# EAGLE design B683X (EAGLE 6.6.0)
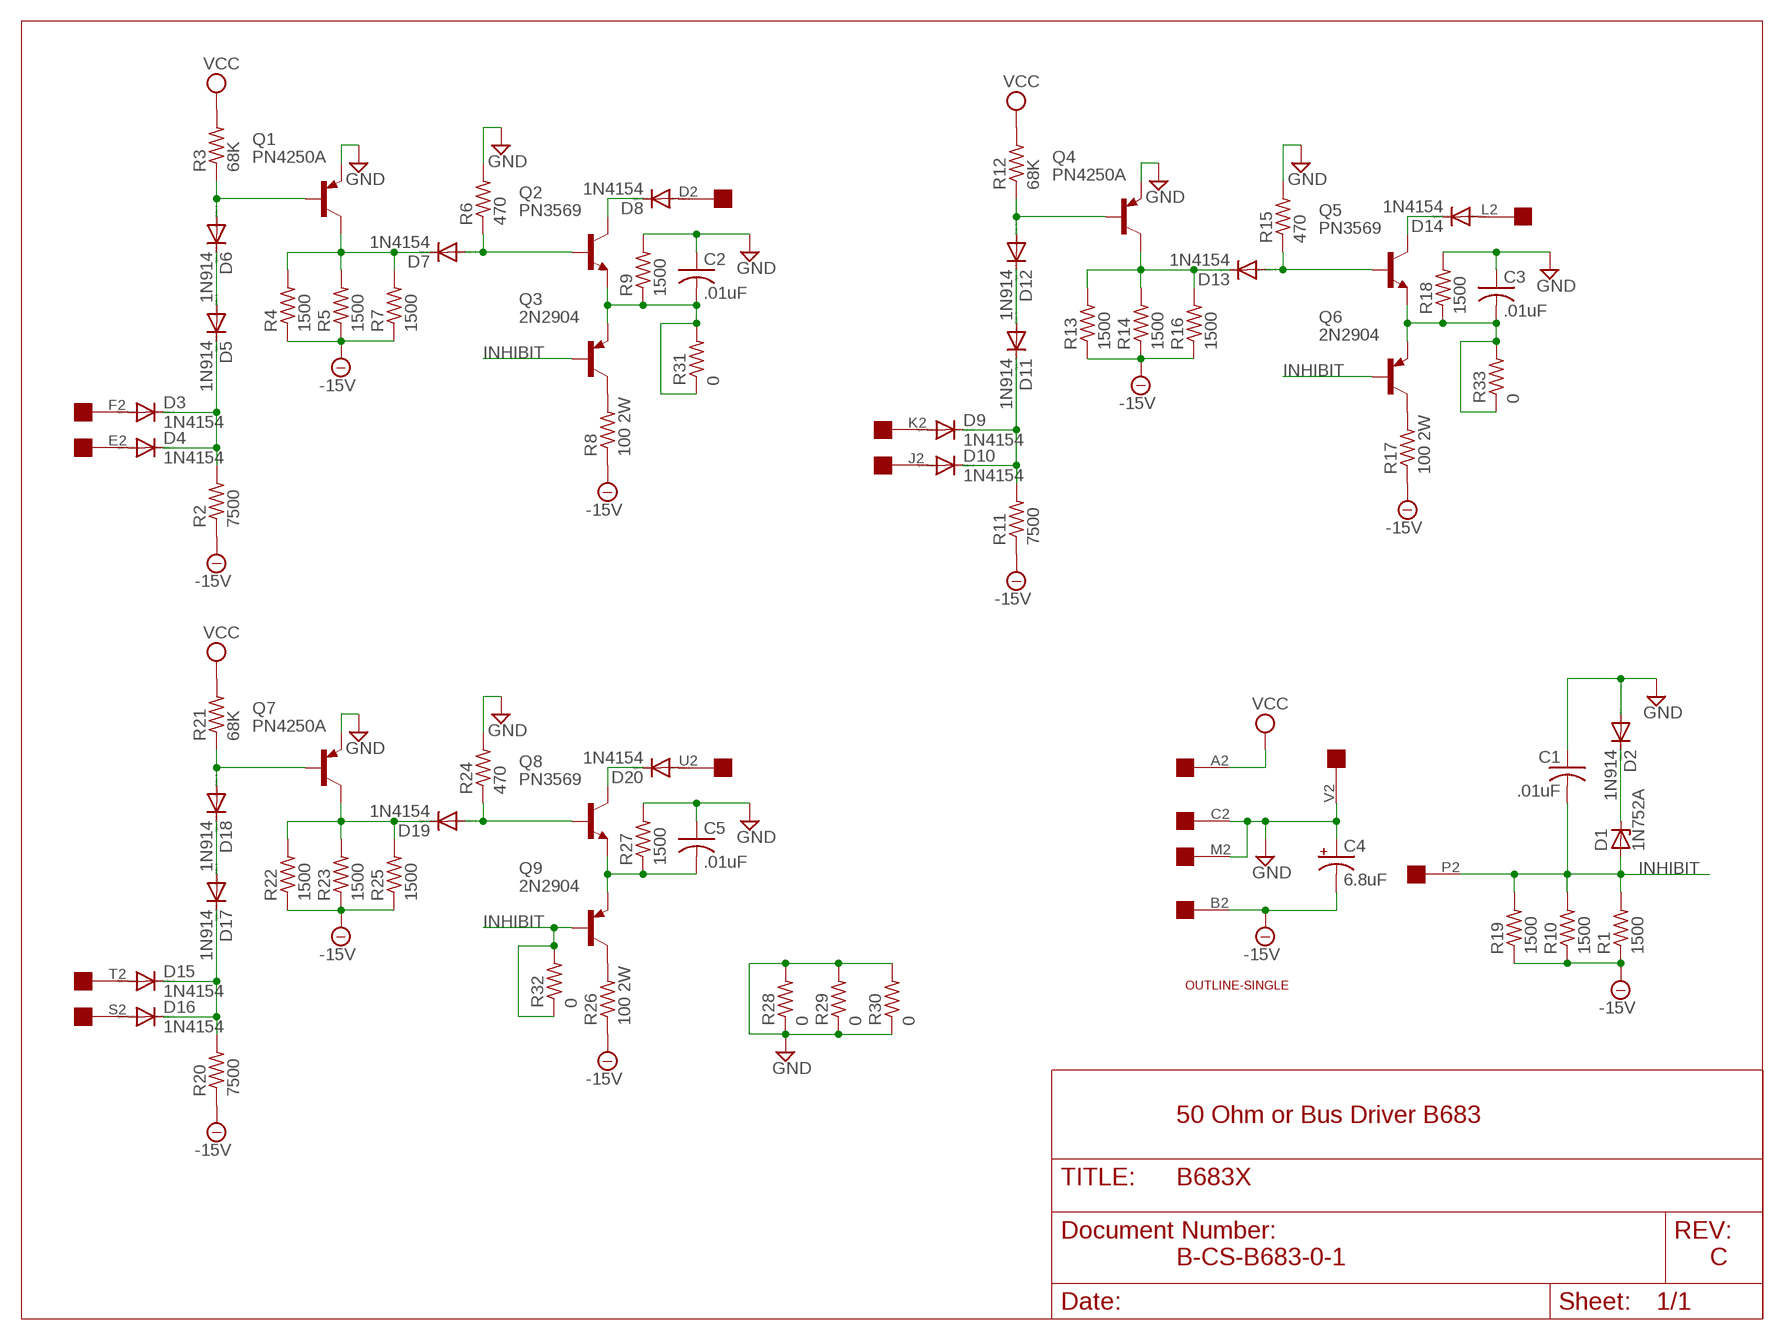
[diagram p0: schematic, sheet 1]

## Parts
C1  .01uF  C-US  [C063-025X075]
C2  .01uF  C-US  [C063-025X075]
C3  .01uF  C-US  [C063-025X075]
C4  6.8uF  CPOL-USE20-8AXIAL  [E12-8]
C5  .01uF  C-US  [C063-025X075]
D1  1N752A  ZENER-DIODEDO35Z10  [DO35Z10]
D2  1N914  DIODE-DO35-10  [DO35-10]
D3  1N4154  DIODE-DO35-10  [DO35-10]
D4  1N4154  DIODE-DO35-10  [DO35-10]
D5  1N914  DIODE-DO35-10  [DO35-10]
D6  1N914  DIODE-DO35-10  [DO35-10]
D7  1N4154  DIODE-DO35-10  [DO35-10]
D8  1N4154  DIODE-DO35-10  [DO35-10]
D9  1N4154  DIODE-DO35-10  [DO35-10]
D10  1N4154  DIODE-DO35-10  [DO35-10]
D11  1N914  DIODE-DO35-10  [DO35-10]
D12  1N914  DIODE-DO35-10  [DO35-10]
D13  1N4154  DIODE-DO35-10  [DO35-10]
D14  1N4154  DIODE-DO35-10  [DO35-10]
D15  1N4154  DIODE-DO35-10  [DO35-10]
D16  1N4154  DIODE-DO35-10  [DO35-10]
D17  1N914  DIODE-DO35-10  [DO35-10]
D18  1N914  DIODE-DO35-10  [DO35-10]
D19  1N4154  DIODE-DO35-10  [DO35-10]
D20  1N4154  DIODE-DO35-10  [DO35-10]
Q1  PN4250A  -PNP-TO5  [TO5]
Q2  PN3569  -NPN-TO5  [TO5]
Q3  2N2904  -PNP-TO5  [TO5]
Q4  PN4250A  -PNP-TO5  [TO5]
Q5  PN3569  -NPN-TO5  [TO5]
Q6  2N2904  -PNP-TO5  [TO5]
Q7  PN4250A  -PNP-TO5  [TO5]
Q8  PN3569  -NPN-TO5  [TO5]
Q9  2N2904  -PNP-TO5  [TO5]
R1  1500  R-US_0207/10  [0207/10]
R2  7500  R-US_0207/10  [0207/10]
R3  68K  R-US_0207/10  [0207/10]
R4  1500  R-US_0207/10  [0207/10]
R5  1500  R-US_0207/10  [0207/10]
R6  470  R-US_0207/10  [0207/10]
R7  1500  R-US_0207/10  [0207/10]
R8  100 2W  R-US_0818/25  [0818/25]
R9  1500  R-US_0207/10  [0207/10]
R10  1500  R-US_0207/10  [0207/10]
R11  7500  R-US_0207/10  [0207/10]
R12  68K  R-US_0207/10  [0207/10]
R13  1500  R-US_0207/10  [0207/10]
R14  1500  R-US_0207/10  [0207/10]
R15  470  R-US_0207/10  [0207/10]
R16  1500  R-US_0207/10  [0207/10]
R17  100 2W  R-US_0818/25  [0818/25]
R18  1500  R-US_0207/10  [0207/10]
R19  1500  R-US_0207/10  [0207/10]
R20  7500  R-US_0207/10  [0207/10]
R21  68K  R-US_0207/10  [0207/10]
R22  1500  R-US_0207/10  [0207/10]
R23  1500  R-US_0207/10  [0207/10]
R24  470  R-US_0207/10  [0207/10]
R25  1500  R-US_0207/10  [0207/10]
R26  100 2W  R-US_0818/25  [0818/25]
R27  1500  R-US_0207/10  [0207/10]
R28  0  R-US_0207/10  [0207/10]
R29  0  R-US_0207/10  [0207/10]
R30  0  R-US_0207/10  [0207/10]
R31  0  R-US_0207/10  [0207/10]
R32  0  R-US_0207/10  [0207/10]
R33  0  R-US_0207/10  [0207/10]
U$1  OUTLINE-SINGLE  [SINGLE]
U$2  EDGE-1  [EDGE-CON1]

## Nets
-15V: C4.- R1.1 R2.1 R4.1 R5.1 R7.1 R8.1 R10.1 R11.1 R13.1 R14.1 R16.1 R17.1 R19.1 R20.1 R22.1 R23.1 R25.1 R26.1 U$2.B2
GND: C1.1 C2.1 C3.1 C4.+ C5.1 D2.A Q1.1(E) Q4.1(E) Q7.1(E) R6.2 R9.2 R15.2 R18.2 R24.2 R27.2 R28.1 R28.2 R29.1 R29.2 R30.1 R30.2 U$2.C2 U$2.M2 U$2.V2
INHIBIT: C1.2 D1.A Q3.2(B) Q6.2(B) Q9.2(B) R1.2 R10.2 R19.2 R32.1 R32.2 U$2.P2
N$1: D6.A Q1.2(B) R3.1
N$2: D1.C D2.C
N$3: D3.C D4.C D5.C R2.2
N$4: D5.A D6.C
N$5: D7.C Q1.3(C) R4.2 R5.2 R7.2
N$6: D7.A Q2.2(B) R6.1
N$7: D8.C Q2.3(C)
N$8: C2.2 Q2.1(E) Q3.1(E) R9.1 R31.1 R31.2
N$9: Q3.3(C) R8.2
N$10: D12.A Q4.2(B) R12.1
N$11: D9.C D10.C D11.C R11.2
N$12: D11.A D12.C
N$13: D13.C Q4.3(C) R13.2 R14.2 R16.2
N$14: D13.A Q5.2(B) R15.1
N$15: D14.C Q5.3(C)
N$16: C3.2 Q5.1(E) Q6.1(E) R18.1 R33.1 R33.2
N$17: Q6.3(C) R17.2
N$18: D18.A Q7.2(B) R21.1
N$19: D15.C D16.C D17.C R20.2
N$20: D17.A D18.C
N$21: D19.C Q7.3(C) R22.2 R23.2 R25.2
N$22: D19.A Q8.2(B) R24.1
N$23: D20.C Q8.3(C)
N$24: C5.2 Q8.1(E) Q9.1(E) R27.1
N$25: Q9.3(C) R26.2
N$26: D8.A U$2.D2
N$27: D3.A U$2.F2
N$28: D4.A U$2.E2
N$29: D9.A U$2.K2
N$30: D10.A U$2.J2
N$31: D14.A U$2.L2
N$32: D20.A U$2.U2
N$33: D15.A U$2.T2
N$34: D16.A U$2.S2
VCC: R3.2 R12.2 R21.2 U$2.A2
Unconnected: U$2.H2 U$2.N2 U$2.R2

## Notes on the sheet
- 50 Ohm or Bus Driver B683
- B-CS-B683-0-1 | C

## Library data of the parts
C1-C3 C5 = dec-con:C-US: Capacitors with funky DEC lead spacing.
C4 = dec-con:CPOL-USE20-8AXIAL: A 0.8 inch electrolytic.
D1 = diode:ZENER-DIODE: Z-Diode
D2-D20 = diode:DIODE-: DIODE
Q1 Q3 Q4 Q6 Q7 Q9 = transistor:*-PNP-: PNP Transistror
Q2 Q5 Q8 = transistor:*-NPN-: NPN Transistror BF959 corrected 2008.03.06
R1-R7 R9-R16 R18-R25 R27-R33 = rcl:R-US_: RESISTOR, American symbol
R8 R17 R26 = dec-con:R-US_0818/25: One inch resistor
U$1 = dec-con:OUTLINE-*: Board outlines for DEC boards.
U$2 = dec-con:EDGE-1: Single-Sided DEC Edge Connector -- (side 2)

## Board
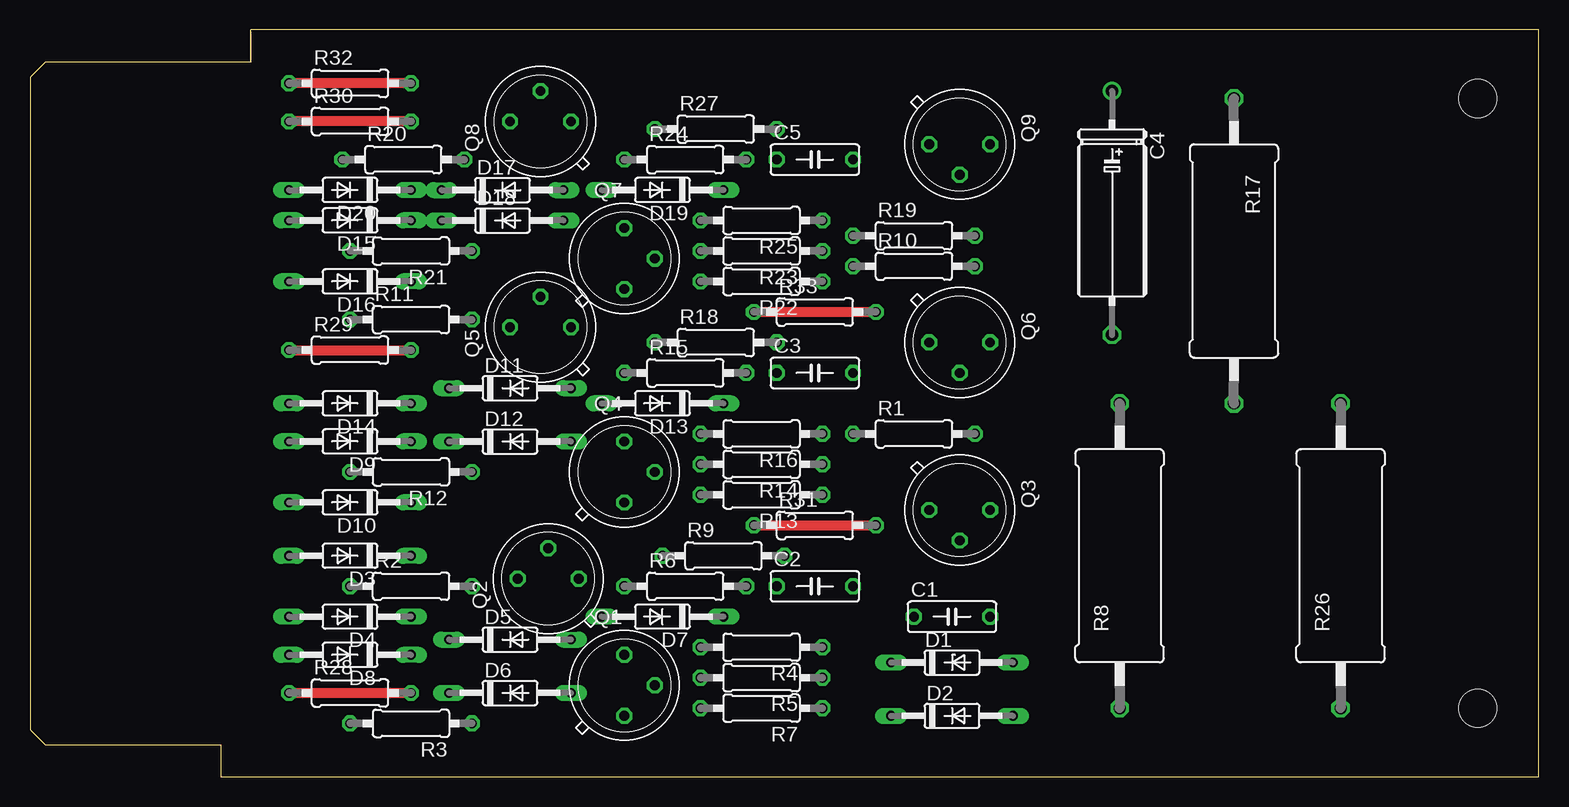
[diagram p1: board, top side]
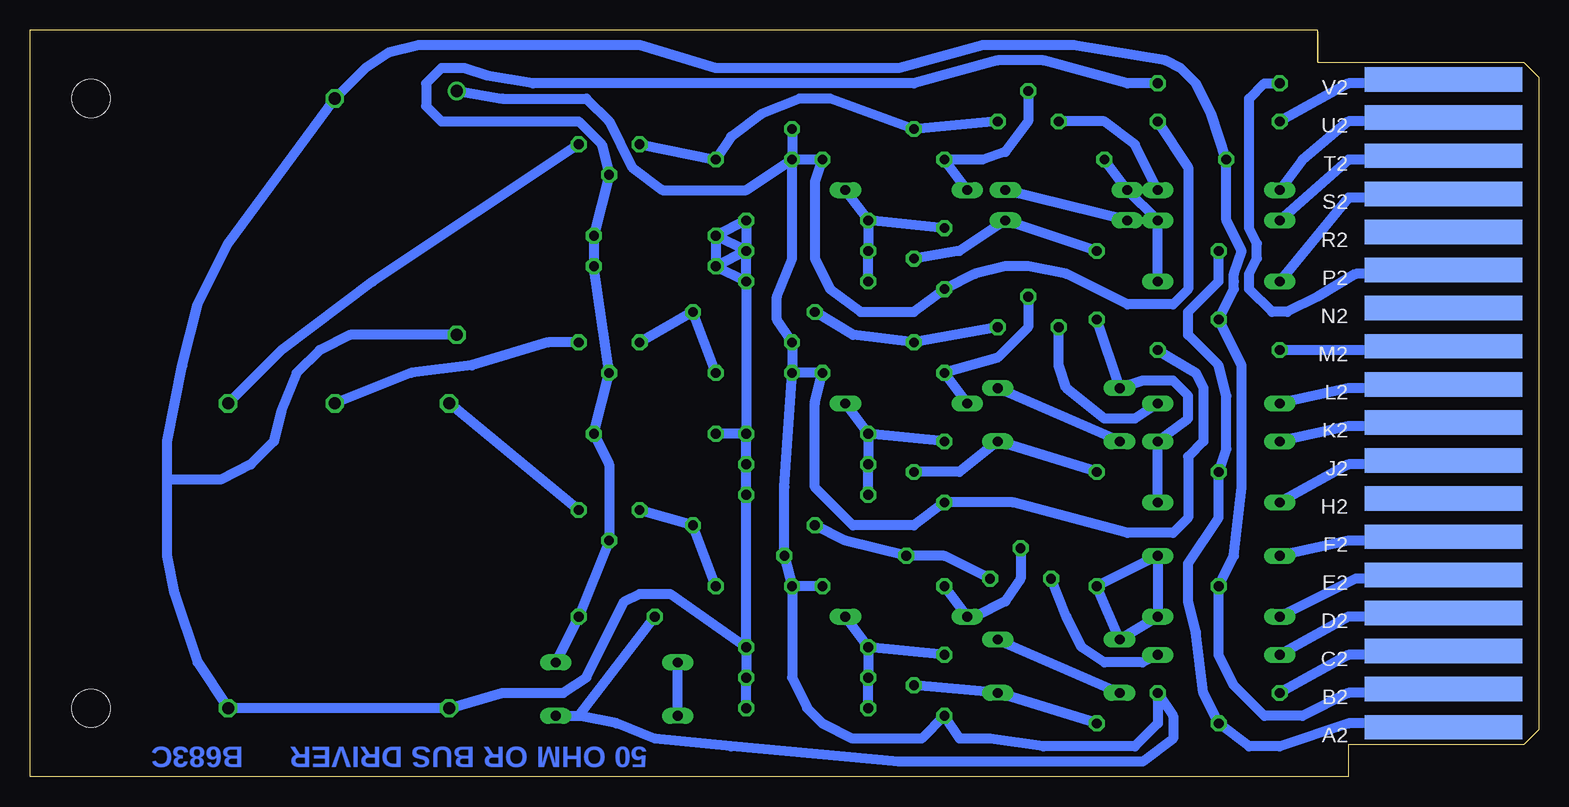
[diagram p2: board, bottom side, seen from below]

Size 125.73 x 62.23 mm. Coordinates in mm from the lower left corner, seen from the top.
Copper layers (1+16): Top 0.035mm / dielectric 1.5mm / Bottom 0.035mm
Design rules "16mils": minimum track width 16mil, minimum drill 32mil, track to track 15mil, track to pad 10mil, pad to pad 10mil, via to via 10mil, smd to smd 10mil, copper to edge 13mil, drill to drill 10mil, minimum pad ring 10mil, minimum via ring 8mil, stop-mask expansion 0mil, vias tented up to drill 0mil, thermal gap 10mil

### Footprints (pad centres in the part's own frame; a part is rotated, then mirrored left to right if it is on the bottom)
C063-025X075 = drill 0.813 octagon: 1 -2.54,0; 2 3.81,0
E12-8 = drill 1.016: + -10.16,0 | drill 1.016 octagon: - 10.16,0
DO35Z10 = drill 0.813 long: A 5.08,0; C -5.08,0
DO35-10 = drill 0.813 long: A 5.08,0; C -5.08,0
TO5 = drill 0.813 octagon: 1 0,-2.54; 2 2.54,0; 3 0,2.54
0207/10 = drill 0.813 octagon: 1 -5.08,0; 2 5.08,0
0818/25 = drill 1.016 octagon: 1 -12.7,0; 2 12.7,0
SINGLE = hole 3.175: 120.65,56.515; 120.65,5.715
EDGE-CON1 = smd 13.106 x 2.032 bottom: A2 7.938,4.128; B2 7.938,7.303; C2 7.938,10.477; D2 7.938,13.652; E2 7.938,16.828; F2 7.938,20.003; H2 7.938,23.177; J2 7.938,26.352; K2 7.938,29.527; L2 7.938,32.703; M2 7.938,35.877; N2 7.938,39.053; P2 7.938,42.227; R2 7.938,45.403; S2 7.938,48.578; T2 7.938,51.752; U2 7.938,54.928; V2 7.938,58.102

### Placement (x,y rotation side)
C1  76.2,13.34 0 top
C2  64.77,15.88 0 top
C3  64.77,33.66 0 top
C4  90.17,46.99 270 top
C5  64.77,51.44 0 top
D1  76.84,9.53 0 top
D2  76.84,5.08 0 top
D3  26.67,18.41 180 top
D4  26.67,13.34 180 top
D5  40.01,11.43 0 top
D6  40.01,6.99 0 top
D7  52.71,13.34 180 top
D8  26.67,10.16 180 top
D9  26.67,27.94 180 top
D10  26.67,22.86 180 top
D11  40.01,32.38 0 top
D12  40.01,27.94 0 top
D13  52.71,31.11 180 top
D14  26.67,31.11 180 top
D15  26.67,46.35 180 top
D16  26.67,41.27 180 top
D17  39.37,48.9 0 top
D18  39.37,46.35 0 top
D19  52.71,48.9 180 top
D20  26.67,48.9 180 top
Q1  49.53,7.62 0 top
Q2  43.18,16.51 90 top
Q3  77.47,22.23 270 top
Q4  49.53,25.4 0 top
Q5  42.55,37.47 90 top
Q6  77.47,36.2 270 top
Q7  49.53,43.18 0 top
Q8  42.55,54.61 90 top
Q9  77.47,52.7 270 top
R1  73.66,28.57 0 top
R2  31.75,15.88 0 top
R3  31.75,4.45 180 top
R4  60.96,10.79 180 top
R5  60.96,8.26 180 top
R6  54.61,15.88 0 top
R7  60.96,5.71 180 top
R8  90.81,18.41 90 top
R9  57.79,18.41 0 top
R10  73.66,42.55 0 top
R11  31.75,38.1 0 top
R12  31.75,25.4 180 top
R13  60.96,23.5 180 top
R14  60.96,26.04 180 top
R15  54.61,33.66 0 top
R16  60.96,28.57 180 top
R17  100.33,43.81 270 top
R18  57.15,36.2 0 top
R19  73.66,45.09 0 top
R20  31.12,51.44 0 top
R21  31.75,43.81 180 top
R22  60.96,41.27 180 top
R23  60.96,43.81 180 top
R24  54.61,51.44 0 top
R25  60.96,46.35 180 top
R26  109.22,18.41 90 top
R27  57.15,53.98 0 top
R28  26.67,6.99 0 top
R29  26.67,35.56 0 top
R30  26.67,54.61 0 top
R31  65.41,20.95 0 top
R32  26.67,57.78 0 top
R33  65.41,38.73 0 top
U$1  0,0 0 top
U$2  0,0 0 top

### Tracks (layer width: path | path; a pad name or v marks a point on that pad's centre or on a via)
-15V
  Bottom 0.813: R7.1 R5.1 R4.1 | U$2.B2 8.89,6.99 15.88,6.99 19.69,5.08 22.86,5.08 25.4,7.62 26.67,10.16 R2.1 25.4,18.41 24.77,24.13 24.77,34.29 R11.1 25.4,40.64 25.4,41.27 25.4,41.91 24.77,43.81 26.04,46.35 R20.1 27.31,55.24 28.58,57.78 29.85,59.05 31.12,59.69 38.74,60.96 46.36,60.96 53.34,59.05 68.58,59.05 74.93,60.96 93.35,60.96 95.89,60.33 97.79,59.05 R17.1 109.22,44.45 111.76,39.37 113.03,34.29 114.3,27.94 114.3,24.77 | R23.1 R25.1 R19.1 | R19.1 R10.1 | R23.1 R10.1 | R10.1 R22.1 | R22.1 R23.1 | R23.1 R19.1 | R22.1 R16.1 | R16.1 R1.1 | R16.1 R14.1 R13.1 R4.1 | R4.1 72.39,15.24 74.93,15.24 76.2,14.61 79.38,8.26 81.28,6.99 86.36,6.99 R8.1 R26.1 111.76,9.53 113.67,15.24 114.3,18.41 114.3,24.77 | C4.- 99.06,36.83 101.6,35.56 103.51,33.66 104.78,30.48 105.41,27.94 107.32,26.04 109.86,24.77 114.3,24.77
GND
  Top 0.813: R29.1 R29.2 | R30.2 R30.1 | R28.1 R28.2
  Bottom 0.813: U$2.V2 8.89,58.1 8.89,57.78 15.88,57.78 R30.1 | U$2.M2 8.89,35.56 R29.1 | U$2.C2 8.89,10.16 15.88,10.16 R28.1 | C4.+ 86.36,56.52 79.38,56.52 77.47,54.61 75.57,50.8 73.03,48.9 66.04,48.9 C5.1 | R27.2 C5.1 | C5.1 R24.2 60.33,49.53 60.33,43.18 59.06,40.64 56.52,38.73 52.07,38.73 Q7.1 46.99,41.91 44.45,42.55 42.55,42.55 39.37,41.91 34.29,39.37 30.48,39.37 29.21,40.64 29.21,50.8 R30.2 | C3.1 R15.2 60.33,31.11 60.33,24.13 57.15,20.95 52.07,20.95 Q4.1 43.82,22.86 34.29,20.32 30.48,20.32 29.21,21.59 29.21,26.67 27.94,27.94 27.94,32.38 28.58,33.66 R29.2 | C3.1 R18.2 63.5,38.1 63.5,40.01 62.23,43.18 C5.1 | D2.A 80.01,5.08 | 80.01,5.08 C1.1 | 80.01,5.08 76.84,4.45 73.66,3.17 67.31,2.54 53.34,1.27 33.02,1.27 30.48,3.17 30.48,5.08 R28.2 31.75,4.45 33.66,2.54 41.28,2.54 45.72,3.17 48.26,3.17 Q1.1 51.44,3.17 57.15,3.17 59.69,4.45 60.96,5.71 62.23,8.26 C2.1 | R6.2 C2.1 | C2.1 R9.2 62.87,24.13 C3.1
INHIBIT
  Top 0.813: R32.2 R32.1
  Bottom 0.813: U$2.P2 9.53,41.91 15.24,41.91 18.42,40.01 20.96,38.73 22.23,38.73 24.13,40.64 24.13,41.91 23.5,43.18 23.5,44.45 24.13,45.72 24.13,56.52 22.86,57.78 R32.1 | R32.2 34.29,57.78 41.28,59.69 45.09,59.69 52.07,57.78 83.82,57.78 87.63,58.42 89.54,59.05 91.44,59.05 92.71,57.78 92.71,55.88 91.44,54.61 80.01,54.61 78.11,52.7 Q9.2 R19.2 R10.2 Q6.2 R1.2 77.47,26.04 Q3.2 C1.2 D1.A
N$1
  Bottom 0.813: R3.1 D6.A Q1.2
N$2
  Bottom 0.813: D2.C D1.C
N$3
  Bottom 0.813: D4.C D5.C R2.2 D3.C D4.C
N$4
  Bottom 0.813: D5.A D6.C
N$5
  Bottom 0.813: D7.C R4.2 | R4.2 R5.2 R7.2 | Q1.3 R4.2
N$6
  Bottom 0.813: Q2.2 43.18,16.51 44.45,14.61 46.99,13.34 D7.A R6.1
N$7
  Bottom 0.813: D8.C 33.02,9.53 36.2,9.53 38.1,10.79 39.37,13.34 Q2.3
N$8
  Top 0.813: R31.1 R31.2
  Bottom 0.813: C2.2 R31.2 Q3.1 | Q2.1 49.53,18.41 R9.1 57.79,19.68 R31.1
N$9
  Bottom 0.813: Q3.3 R8.2
N$10
  Bottom 0.813: R12.1 D12.A 48.26,25.4 Q4.2
N$11
  Bottom 0.813: R11.2 D11.C 33.02,33.02 30.48,33.02 29.21,31.75 29.21,29.84 D9.C D10.C
N$12
  Bottom 0.813: D12.C D11.A
N$13
  Bottom 0.813: Q4.3 R16.2 | R16.2 R14.2 R13.2 | D13.C R16.2
N$14
  Bottom 0.813: D13.A R15.1 45.09,34.92 42.55,37.47 Q5.2
N$15
  Bottom 0.813: D14.C 33.66,29.84 36.2,29.84 39.37,32.38 40.01,34.29 Q5.3
N$16
  Top 0.813: R33.1 R33.2
  Bottom 0.813: Q5.1 R18.1 57.15,36.83 R33.1 | C3.2 R33.2 Q6.1
N$17
  Bottom 0.813: Q6.3 82.55,36.2 88.9,34.29 93.98,33.66 R17.2
N$18
  Bottom 0.813: R21.1 D18.A 48.26,43.81 Q7.2
N$19
  Bottom 0.813: D16.C D15.C D17.C R20.2
N$20
  Bottom 0.813: D18.C D17.A
N$21
  Bottom 0.813: Q7.3 R25.2 | R25.2 R23.2 R22.2 | D19.C R25.2
N$22
  Bottom 0.813: Q8.2 42.55,54.61 44.45,52.07 46.36,51.44 R24.1 D19.A
N$23
  Bottom 0.813: D20.C 33.66,52.7 36.2,54.61 Q8.3
N$24
  Bottom 0.813: Q9.1 C5.2 67.31,53.34 64.77,55.24 61.6,56.52 59.06,56.52 R27.1 Q8.1
N$25
  Bottom 0.813: Q9.3 97.16,41.27 104.78,35.56 R26.2
N$26
  Bottom 0.813: U$2.D2 8.26,13.34 15.88,13.34 D8.A
N$27
  Bottom 0.813: U$2.F2 8.89,19.68 15.88,19.68 D3.A
N$28
  Bottom 0.813: U$2.E2 8.89,16.51 15.24,16.51 D4.A
N$29
  Bottom 0.813: U$2.K2 8.89,29.21 15.88,29.21 D9.A
N$30
  Bottom 0.813: U$2.J2 8.89,26.04 15.88,26.04 D10.A
N$31
  Bottom 0.813: U$2.L2 8.89,32.38 15.88,32.38 D14.A
N$32
  Bottom 0.813: U$2.U2 8.89,54.61 15.88,54.61 19.69,51.44 D20.A
N$33
  Bottom 0.813: U$2.T2 8.89,51.44 15.88,51.44 D15.A
N$34
  Bottom 0.813: U$2.S2 8.26,48.26 15.88,48.26 D16.A
VCC
  Bottom 0.813: U$2.A2 8.89,4.45 15.88,4.45 21.59,2.54 24.13,2.54 R3.2 27.94,6.99 28.58,12.06 29.21,14.61 29.21,17.78 26.67,21.59 R12.2 26.04,27.3 26.04,31.75 26.67,34.29 29.21,36.83 29.21,38.73 26.67,41.27 R21.2

### Text on the board
Bottom: 50 OHM OR BUS DRIVER | B683C